# EAGLE design SpecAnalGraphics (EAGLE 5.06)
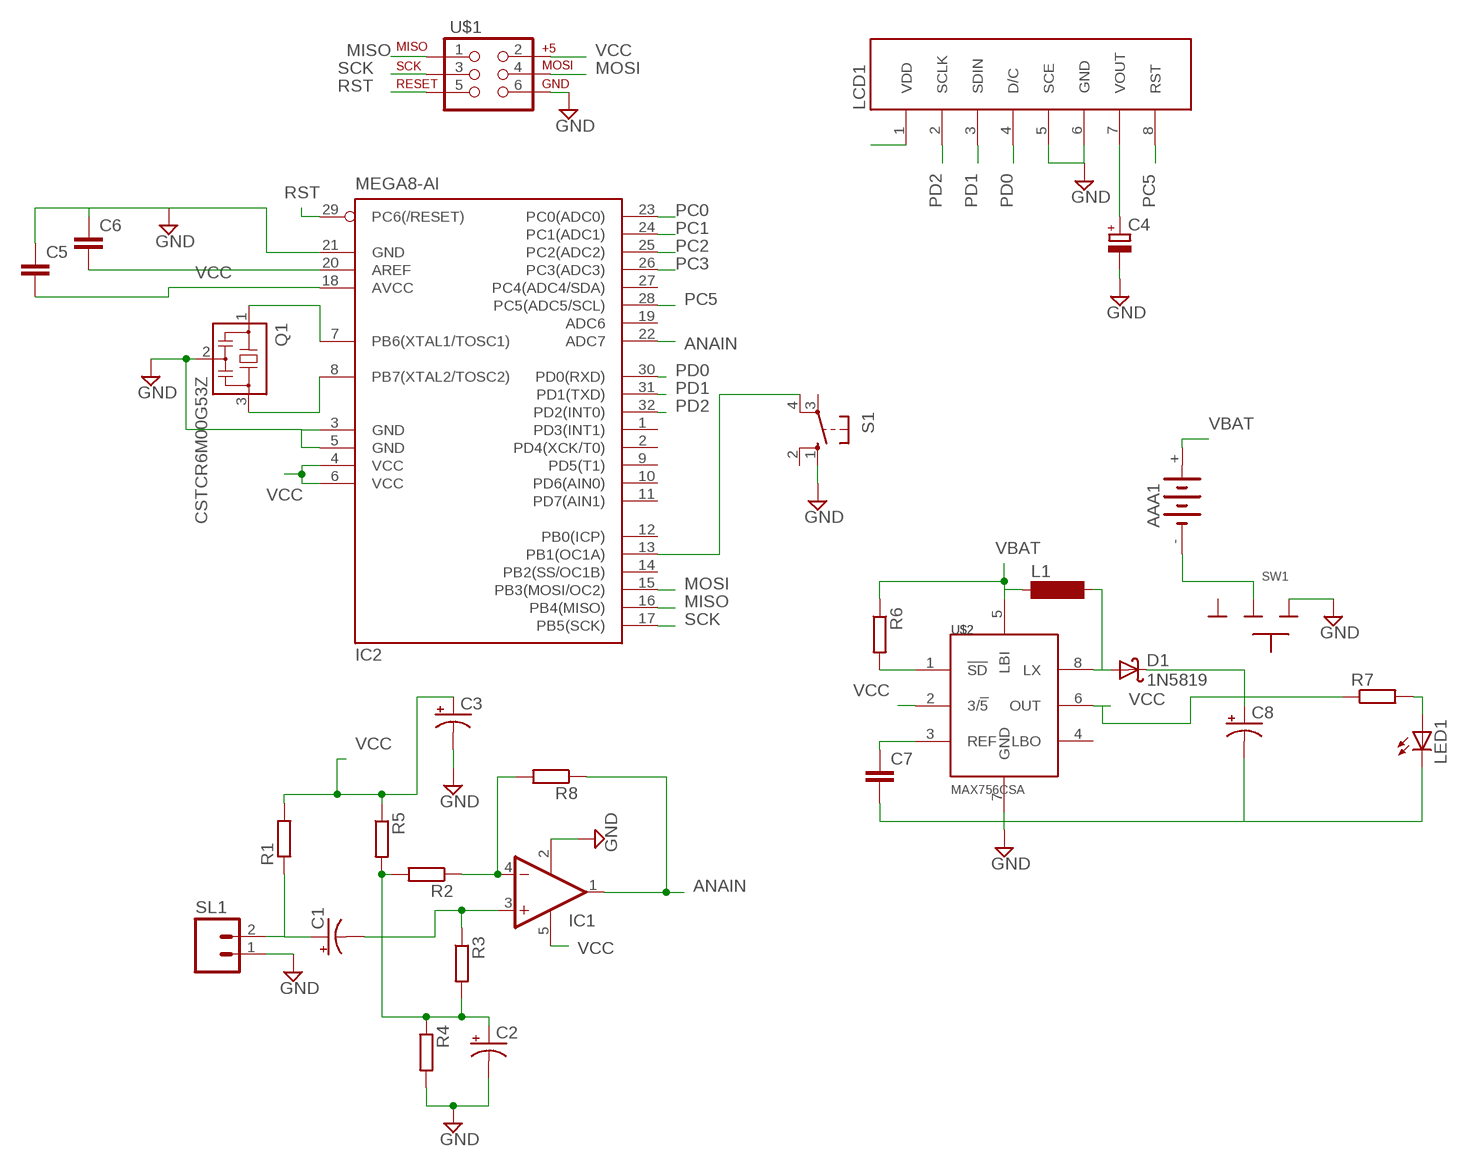
[diagram p0: schematic, sheet 1]

## Parts
AAA1  AAAAAASMT  [AAASMT]
C1  POLARIZED_CAPACITORA3216-18  [A3216-18]
C2  POLARIZED_CAPACITORA3216-18  [A3216-18]
C3  POLARIZED_CAPACITORA3216-18  [A3216-18]
C4  CPOL-EUE2-4  [E2-4]
C5  C-EUC0805  [C0805]
C6  C-EUC0805  [C0805]
C7  C-EUC0805  [C0805]
C8  POLARIZED_CAPACITORA3216-18  [A3216-18]
D1  1N5819  [DO41-10]
IC1  OPA344N-SOT23  [SOT23-5]
IC2  MEGA8-AI  [TQFP32-08]
L1  MS50  [MS50]
LCD1  NOKIA3310LCDHOLE  [NOKIA3310LCDHOLE]
LED1  LED3MM  [LED3MM]
Q1  CSTCR6M00G53Z  [CSTCR6M]
R1  R-EU_0204/7  [0204/7]
R2  R-EU_0204/7  [0204/7]
R3  R-EU_0204/7  [0204/7]
R4  R-EU_0204/7  [0204/7]
R5  R-EU_0204/7  [0204/7]
R6  R-EU_0204/7  [0204/7]
R7  R-EU_0204/7  [0204/7]
R8  R-EU_0204/7  [0204/7]
S1  10-XX  [B3F-10XX]
SL1  M02  [02P]
SW1  SLIDESWITCHSMALL  [SMALLSWITCH]
U$1  AVR_SPI_PRG_6NS  [2X3-NS]
U$2  MAX756CSA  [SO8]

## Nets
ANAIN: IC1.1(OUT) IC2.22(ADC7) R8.1
GND: C2.- C3.- C4.- C5.1 C6.1 C7.2 C8.- IC1.2(V-) IC2.3(GND) IC2.5(GND) IC2.21(GND) LCD1.5(SCE) LCD1.6(GND) LED1.K(C) Q1.2 R4.2 S1.1(S) SL1.1 SW1.1 U$1.6 U$2.7(GND)
MISO: IC2.16(PB4(MISO)) U$1.1
MOSI: IC2.15(PB3(MOSI/OC2)) U$1.4
N$1: IC2.7(PB6(XTAL1/TOSC1)) Q1.1
N$2: C1.+ R1.1 SL1.2
N$3: IC1.4(-IN) R2.1 R8.2
N$4: C1.- IC1.3(+IN) R3.1
N$5: IC2.8(PB7(XTAL2/TOSC2)) Q1.3
N$6: C2.+ R2.2 R3.2 R4.1 R5.2
N$7: C6.2 IC2.20(AREF)
N$10: LCD1.1(VDD)
N$11: C4.+ LCD1.7(VOUT)
N$12: AAA1.- SW1.2
N$13: C7.1 U$2.3(REF)
N$14: D1.A L1.2 U$2.8(LX)
N$15: R6.2 U$2.1(!SD)
N$16: IC2.13(PB1(OC1A)) S1.4(P1)
N$17: LED1.A R7.2
PC0: IC2.23(PC0(ADC0))
PC1: IC2.24(PC1(ADC1))
PC2: IC2.25(PC2(ADC2))
PC3: IC2.26(PC3(ADC3))
PC5: IC2.28(PC5(ADC5/SCL)) LCD1.8(RST)
PD0: IC2.30(PD0(RXD)) LCD1.4(D/C)
PD1: IC2.31(PD1(TXD)) LCD1.3(SDIN)
PD2: IC2.32(PD2(INT0)) LCD1.2(SCLK)
RST: IC2.29(PC6(/RESET)) U$1.5
SCK: IC2.17(PB5(SCK)) U$1.3
VBAT: AAA1.+ L1.1 R6.1 U$2.5(LBI)
VCC: C3.+ C5.2 C8.+ D1.C IC1.5(V+) IC2.4(VCC) IC2.6(VCC) IC2.18(AVCC) R1.2 R5.1 R7.1 U$1.2 U$2.2(3/!5) U$2.6(OUT)
Unconnected: IC2.1(PD3(INT1)) IC2.2(PD4(XCK/T0)) IC2.9(PD5(T1)) IC2.10(PD6(AIN0)) IC2.11(PD7(AIN1)) IC2.12(PB0(ICP)) IC2.14(PB2(SS/OC1B)) IC2.19(ADC6) IC2.27(PC4(ADC4/SDA)) S1.2(S1) S1.3(P) SW1.3 U$2.4(LBO)

## Library data of the parts
AAA1 = CEDTv110:AAA
C1-C3 C8 = ng:POLARIZED_CAPACITOR: polarized capacitor
C4 = rcl:CPOL-EU: POLARIZED CAPACITOR, European symbol
C5-C7 = rcl:C-EU: CAPACITOR, European symbol
D1 = CEDTv110:1N5819: DIODE general purpose rectifier, 1 A
IC1 = linear:OPA*-SOT23: Single Operational Amplifier Low Power, Single-Supply, Rail-To-Rail Operational Amplifier Source: http://focus.ti.com/lit/ds/symlink/opa2345.pdf
IC2 = atmel:MEGA8: MICROCONTROLLER 8 Kbytes FLASH, 1 kbytes SRAM, 512 bytes EEPROM, USART, 6-channel 10 bit ADC, 2-channel 8 bit ADC Pin compatible with Atmega48, ATMega88, ATMega168 Source: avr.lbr
L1 = inductor-neosid:MS50: INDUCTOR SMD power inductor
LCD1 = avr32ucbPBB:NOKIA3310LCD
LED1 = led:LED: LED OSRAM: - CHIPLED LG R971, LG N971, LY N971, LG Q971, LY Q971, LO R971, LY R971 LH N974, LH R974 LS Q976, LO Q976, LY Q976 LO Q996 - Hyper CHIPLED LW Q18S LB Q993, LB Q99A, LB R99A - SideLED LS A670, LO A670, LY A670, LG A670, LP A670 LB A673, LV A673, LT A673, LW A673 LH A674 LY A675 LS A676, LA A676, LO A676, LY A676, LW A676 LS A679, LY A679, LG A679 - Hyper Micro SIDELED® LS Y876, LA Y876, LO Y876, LY Y876 LT Y87S - SmartLED LW L88C, LW L88S LB L89C, LB L89S, LG L890 LS L89K, LO L89K, LY L89K LS L896, LA L896, LO L896, LY L896 - TOPLED LS T670, LO T670, LY T670, LG T670, LP T670 LSG T670, LSP T670, LSY T670, LOP T670, LYG T670 LG T671, LOG T671, LSG T671 LB T673, LV T673, LT T673, LW T673 LH T674 LS T676, LA T676, LO T676, LY T676, LB T676, LH T676, LSB T676, LW T676 LB T67C, LV T67C, LT T67C, LS T67K, LO T67K, LY T67K, LW E67C LS E67B, LA E67B, LO E67B, LY E67B, LB E67C, LV E67C, LT E67C LW T67C LS T679, LY T679, LG T679 LS T770, LO T770, LY T770, LG T770, LP T770 LB T773, LV T773, LT T773, LW T773 LH T774 LS E675, LA E675, LY E675, LS T675 LS T776, LA T776, LO T776, LY T776, LB T776 LHGB T686 LT T68C, LB T68C - Hyper Mini TOPLED® LB M676 - Mini TOPLED Santana® LG M470 LS M47K, LO M47K, LY M47K Source: http://www.osram.convergy.de LUXEON: - LUMILED® LXK2-PW12-R00, LXK2-PW12-S00, LXK2-PW14-U00, LXK2-PW14-V00 LXK2-PM12-R00, LXK2-PM12-S00, LXK2-PM14-U00 LXK2-PE12-Q00, LXK2-PE12-R00, LXK2-PE12-S00, LXK2-PE14-T00, LXK2-PE14-U00 LXK2-PB12-K00, LXK2-PB12-L00, LXK2-PB12-M00, LXK2-PB14-N00, LXK2-PB14-P00, LXK2-PB14-Q00 LXK2-PR12-L00, LXK2-PR12-M00, LXK2-PR14-Q00, LXK2-PR14-R00 LXK2-PD12-Q00, LXK2-PD12-R00, LXK2-PD12-S00 LXK2-PH12-R00, LXK2-PH12-S00 LXK2-PL12-P00, LXK2-PL12-Q00, LXK2-PL12-R00 Source: www.luxeon.com KINGBRIGHT: KA-3528ASYC Source: www.kingbright.com
Q1 = murata-filter:CSTCR: Resonator Source: murata.co.jp
R1-R8 = rcl:R-EU_: RESISTOR, European symbol
S1 = switch-omron:10-XX: OMRON SWITCH
SL1 = con-amp-quick:M02: AMP QUICK CONNECTOR
SW1 = CEDTv110:SLIDESWITCHSMALL
U$1 = SparkFunOct08:AVR_SPI_PRG_6: AVR ISP 6 Pin This is the reduced ISP connector for AVR programming. Common on Arduino. This footprint will take up less PCB space and can be used with a 10-pin to 6-pin adapter such as SKU: BOB-08508
U$2 = nnTec.eagle:MAX756: Step Up DC-DC Converter

## Board
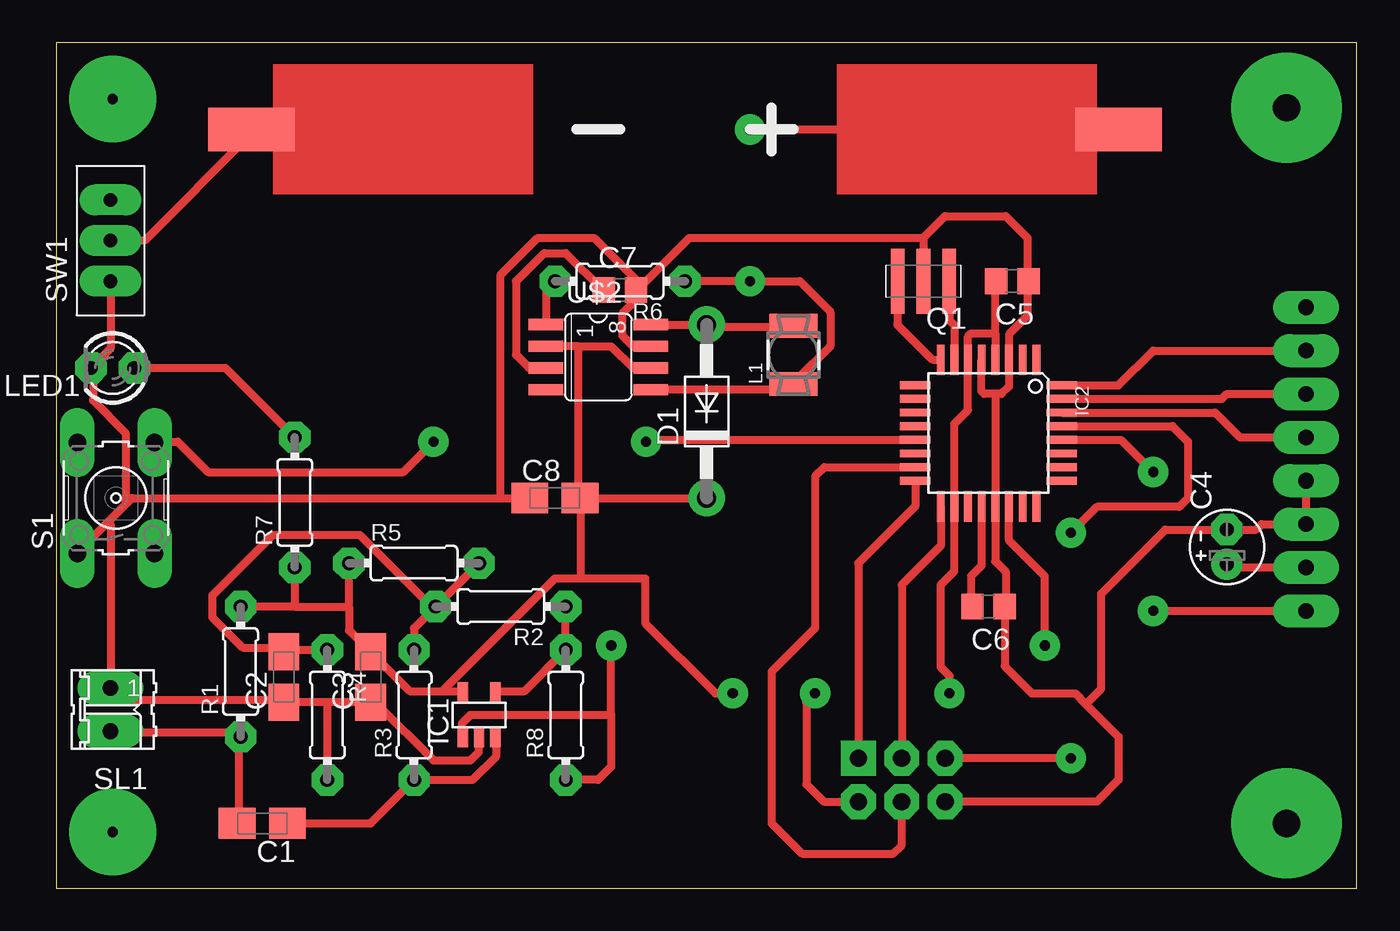
[diagram p1: board, top side]
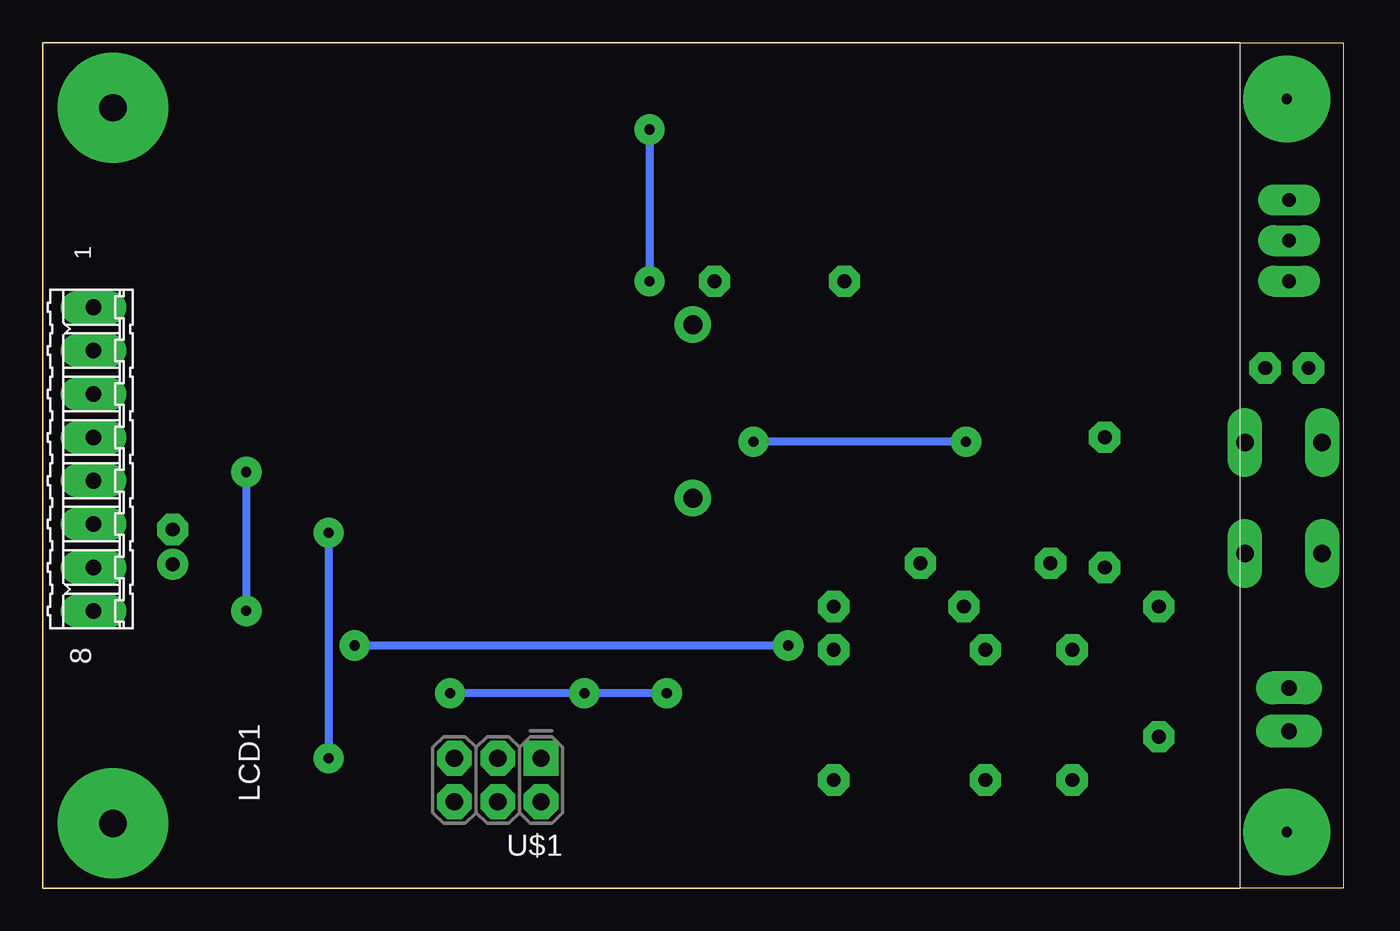
[diagram p2: board, bottom side, seen from below]

Size 76.19 x 49.52 mm. Coordinates in mm from the lower left corner, seen from the top.
Outline: 0,49.52 0,0 76.19,0 76.19,49.52 0,49.52
Copper layers (1*16): Top 0.035mm / dielectric 1.5mm / Bottom 0.035mm
Design rules "default *": minimum track width 18mil, minimum drill 24mil, track to track 16mil, track to pad 16mil, pad to pad 16mil, via to via 16mil, smd to smd 16mil, copper to edge 40mil, drill to drill 16mil, minimum pad ring 20mil, minimum via ring 20mil, stop-mask expansion 4mil, vias tented up to drill 0mil, thermal gap 10mil

### Footprints (pad centres in the part's own frame; a part is rotated, then mirrored left to right if it is on the bottom)
AAASMT = smd 5.08 x 2.54: + 53.34,0; - 2.54,0
A3216-18 = smd 2.15 x 1.8: + 1.475,0; - -1.475,0
E2-4 = drill 0.813 pad 1.27 round: + -1.016,0 | drill 0.813 pad 1.27 octagon: - 1.016,0
C0805 = smd 1.3 x 1.5: 1 -0.95,0; 2 0.95,0
DO41-10 = drill 1.118 round: A 5.08,0; C -5.08,0
SOT23-5 = smd 0.6 x 1.2: 1 -0.95,-1.306; 2 0,-1.306; 3 0.95,-1.306; 4 0.95,1.306; 5 -0.95,1.306
TQFP32-08 = smd 1.778 x 0.457: 1 -4.293,2.8; 2 -4.293,2; 3 -4.293,1.2; 4 -4.293,0.4; 5 -4.293,-0.4; 6 -4.293,-1.2; 7 -4.293,-2; 8 -4.293,-2.8; 17 4.293,-2.8; 18 4.293,-2; 19 4.293,-1.2; 20 4.293,-0.4; 21 4.293,0.4; 22 4.293,1.2; 23 4.293,2; 24 4.293,2.8 | smd 0.457 x 1.778: 9 -2.8,-4.293; 10 -2,-4.293; 11 -1.2,-4.293; 12 -0.4,-4.293; 13 0.4,-4.293; 14 1.2,-4.293; 15 2,-4.293; 16 2.8,-4.293; 25 2.8,4.293; 26 2,4.293; 27 1.2,4.293; 28 0.4,4.293; 29 -0.4,4.293; 30 -1.2,4.293; 31 -2,4.293; 32 -2.8,4.293
MS50 = smd 2.8 x 1.4: 1 0,-1.7; 2 0,1.7
NOKIA3310LCDHOLE = drill 0.914 long: 1 34.036,67.183; 2 31.496,67.183; 3 28.956,67.183; 4 26.416,67.183; 5 23.876,67.183; 6 21.336,67.183; 7 18.796,67.183; 8 16.256,67.183 | drill 1.6 pad 6.452 round: P$1 3.81,66.04; P$2 45.72,66.04
LED3MM = drill 0.813 octagon: A -1.27,0; K 1.27,0
CSTCR6M = smd 0.8 x 3.81: 1 -1.5,0; 2 0,0; 3 1.5,0
0204/7 = drill 0.813 octagon: 1 -3.81,0; 2 3.81,0
B3F-10XX = drill 1.016 long: 1 -3.251,2.261; 2 3.251,2.261; 3 -3.251,-2.261; 4 3.251,-2.261
02P = drill 0.914 long: 1 -1.27,0; 2 1.27,0
SMALLSWITCH = drill 0.8 long: 1 -2.54,0; 2 -0.159,0; 3 2.223,0
2X3-NS = drill 1.016 square: 1 -2.54,-1.27 | drill 1.016 octagon: 2 -2.54,1.27; 3 0,-1.27; 4 0,1.27; 5 2.54,-1.27; 6 2.54,1.27
SO8 = smd 0.66 x 2.032: 1 -1.27,-3.073; 2 0,-3.073; 3 1.27,-3.073; 4 2.54,-3.073; 5 2.54,3.073; 6 1.27,3.073; 7 0,3.073; 8 -1.27,3.073

### Placement (x,y rotation side)
AAA1  8.89,44.44 0 top
C1  12.06,3.8 180 top
C2  13.34,12.37 90 top
C3  18.41,12.37 90 top
C4  68.58,19.99 90 top
C5  56.01,35.55 180 top
C6  54.61,16.5 180 top
C7  33.02,35.04 0 top
C8  29.21,22.85 0 top
D1  38.1,27.93 90 top
IC1  24.77,10.15 0 top
IC2  54.61,26.66 270 top
L1  43.18,31.23 0 top
LCD1  6.03,-0.01 90 bottom
LED1  3.3,30.47 180 top
Q1  50.8,35.55 180 top
R1  10.79,12.69 90 top
R2  26.04,16.5 180 top
R3  20.95,10.15 90 top
R4  15.88,10.15 270 top
R5  20.95,19.04 0 top
R6  33.02,35.55 180 top
R7  13.97,22.59 90 top
R8  29.84,10.15 90 top
S1  3.49,22.85 90 top
SL1  3.17,10.47 270 top
SW1  3.17,38.09 90 top
U$1  49.53,6.34 180 bottom
U$2  31.75,31.74 270 top

### Tracks (layer width: path | path; a pad name or v marks a point on that pad's centre or on a via)
ANAIN  (via drill 0.6 pad 1.78)
  Top 0.457: IC2.22 55.81,20.38 57.91,18.28 v57.91,14.21 | 32.51,10.15 v32.51,14.21 | 32.51,10.15 32.51,7.1 31.75,6.34 R8.1 | IC1.1 23.75,8.88 23.75,9.64 24.26,10.15 32.51,10.15
  Bottom 0.457: v32.51,14.21 v57.91,14.21
GND
  Top 0.457: LCD1.5 LCD1.6 70.61,21.32 70.29,21.01 C4.- 64.96,21.01 61.21,17.26 61.21,11.67 60.33,10.78 | 60.33,10.78 59.69,11.42 57.15,11.42 55.56,13.01 C6.1 55.63,16.56 55.63,18.53 55.01,19.15 IC2.21 55.01,28.84 55.12,28.94 | 60.33,10.78 62.23,8.88 62.23,6.34 60.96,5.07 U$1.6 | 55.12,28.94 55.37,28.94 55.81,29.38 IC2.3 55.81,32.43 56.9,33.52 56.9,35.49 C5.1 56.9,35.61 56.9,38.09 55.63,39.36 52.07,39.36 50.8,38.09 | 55.12,28.94 54.36,28.94 54.21,29.09 IC2.5 | 50.8,38.09 Q1.2 | C7.2 33.91,35.04 33.91,34.4 33.15,33.64 33.15,32.37 33.78,31.74 U$2.7 | C7.2 34.16,35.17 37.08,38.09 50.8,38.09 | IC1.2 24.77,7.99 24.26,7.48 22.1,7.48 18.8,10.78 18.41,10.78 C3.- 18.29,10.91 15.88,10.91 | 15.88,10.91 13.34,10.91 C2.- 13.21,11.04 3.81,11.04 3.3,11.54 SL1.1 3.17,21.32 3.05,21.45 | 15.88,10.91 R4.2 | 26.04,22.85 4.45,22.85 4.19,22.59 | 3.05,21.45 1.27,19.67 S1.1 | 4.19,22.59 3.05,21.45 | C7.2 34.16,35.42 31.5,38.09 28.19,38.09 26.04,35.93 26.04,22.85 | 26.04,22.85 C8.- | SW1.1 3.17,31.61 LED1.K 2.16,30.34 2.16,28.56 4.06,26.66 4.06,22.72 4.19,22.59
MISO
  Top 0.457: IC2.16 50.32,22.36 46.99,19.04 U$1.1
MOSI
  Top 0.457: IC2.15 44.99,24.66 44.45,24.12 44.45,15.23 41.91,12.69 41.91,3.8 43.69,2.02 49.02,2.02 49.53,2.53 U$1.4
N$1
  Top 0.457: IC2.7 52.61,32.98 52.32,33.26 52.32,35.52 Q1.1
N$2
  Top 0.457: C1.+ 10.67,3.8 10.67,8.75 R1.1 10.54,8.88 10.29,9.13 3.17,9.13 SL1.2
N$3
  Top 0.457: IC1.4 25.78,11.54 27.43,11.54 R8.2 R2.1
N$4
  Top 0.457: IC1.3 25.78,8.75 25.78,7.73 24.38,6.34 R3.1 18.41,3.8 C1.-
N$5
  Top 0.457: IC2.8 51.33,30.95 49.28,33.01 49.28,35.52 Q1.3
N$6
  Top 0.457: R4.1 13.34,13.96 C2.+ 13.21,14.08 10.92,14.08 9.14,15.86 9.14,17.13 12.7,20.69 17.78,20.69 21.97,16.5 R2.2 | R2.2 R5.2 | R3.2 20.95,15.23 R2.2
N$7
  Top 0.457: IC2.20 54.21,18.89 53.59,18.28 53.59,16.56 C6.2
N$8  (via drill 0.6 pad 5.08)
  other vias: 3.3,46.22
N$9  (via drill 0.6 pad 5.08)
  other vias: 3.3,3.29
N$11
  Top 0.457: C4.+ 69.15,18.97 69.34,18.78 LCD1.7
N$12
  Top 0.457: 11.43,44.18 AAA1.- 11.3,44.06 5.21,37.96 3.17,37.96 SW1.2
N$13
  Top 0.457: C7.1 32,35.04 29.84,37.2 28.57,37.2 26.92,35.55 26.92,31.23 27.69,30.47 U$2.3
N$14
  Top 0.457: U$2.8 D1.A 38.23,32.88 43.18,32.88 L1.2
N$15
  Top 0.457: R6.2 28.7,35.04 28.7,33.01 U$2.1
N$16  (via drill 0.6 pad 1.78)
  Top 0.457: IC2.13 34.65,26.26 v34.54,26.15 | v22.1,26.15 20.32,24.37 8.89,24.37 7.11,26.15 5.8,26.15 S1.4
  Bottom 0.457: v22.1,26.15 v34.54,26.15
N$17
  Top 0.457: LED1.A 9.91,30.47 R7.2
PC5  (via drill 0.6 pad 1.78)
  Top 0.457: IC2.28 62.38,26.26 v64.26,24.37 | v64.26,16.24 LCD1.8
  Bottom 0.457: v64.26,24.37 v64.26,16.24
PD0
  Top 0.457: IC2.30 67.89,27.86 69.34,26.4 LCD1.4
PD1
  Top 0.457: IC2.31 68.29,28.66 68.58,28.94 LCD1.3
PD2
  Top 0.457: IC2.32 62.23,29.45 64.26,31.48 LCD1.2
RST  (via drill 0.6 pad 1.78)
  Top 0.457: IC2.29 65.39,27.06 66.29,26.15 66.29,22.85 65.79,22.34 60.96,22.34 v59.44,20.82 | v59.44,7.61 U$1.5
  Bottom 0.457: v59.44,20.82 v59.44,7.61
SCK
  Top 0.457: U$1.3 49.53,17.77 51.81,20.05 IC2.17
VBAT  (via drill 0.6 pad 1.78)
  Top 0.457: U$2.5 42.93,29.2 43.18,29.45 L1.1 43.31,29.71 45.34,31.74 45.34,33.77 43.56,35.55 v40.64,35.55 R6.1 | v40.64,44.44 AAA1.+
  Bottom 0.457: v40.64,44.44 v40.64,35.55
VCC  (via drill 0.6 pad 1.78)
  Top 0.457: 55.01,32.5 IC2.4 | 55.01,32.5 53.59,32.5 53.41,32.32 IC2.6 53.41,28 52.61,27.2 IC2.18 52.61,18.56 51.82,17.77 51.82,12.94 52.32,12.43 v52.32,11.42 | U$1.2 44.96,5.07 43.94,6.08 43.94,10.91 v44.45,11.42 | v39.62,11.42 38.61,11.42 34.49,15.53 34.49,18.15 30.73,18.15 | 30.61,31.74 U$2.2 | 30.61,31.74 32.51,31.74 33.78,30.47 U$2.6 | 22.73,11.54 20.7,11.54 C3.+ 18.29,13.96 17.14,15.1 17.14,16.5 | 22.73,11.54 23.75,11.54 IC1.5 | 17.14,16.5 R5.1 | 13.97,16.5 R1.2 | 13.97,16.5 17.14,16.5 | 30.73,18.15 29.21,18.15 22.73,11.67 22.73,11.54 | C8.+ 30.73,22.85 30.73,18.15 | C8.+ D1.C | 30.61,31.74 30.61,22.97 C8.+ | 55.01,32.5 55.01,35.5 C5.2 | R7.1 13.97,16.5
  Bottom 0.457: v52.32,11.42 v44.45,11.42 v39.62,11.42